# EAGLE design amp (EAGLE 9.6.2)
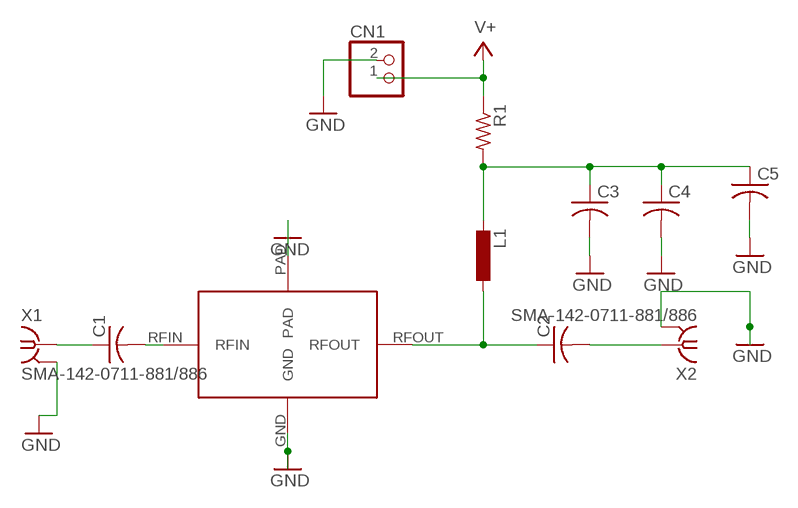
[diagram p0: schematic, sheet 1]

## Parts
C1  C-USC0603  [C0603]
C2  C-USC0603  [C0603]
C3  C-USC0603  [C0603]
C4  C-USC0603  [C0603]
C5  C-USC0603  [C0603]
CN1  JST_2PIN-THM  [JST-PH-2-THM]
L1  L-EUL0603  [L0603]
R1  R-US_R0603  [R0603]
U$1  MMG3001  [SOT-89]
X1  SMA-142-0711-881/886  [J502-ND-142-0711-881/886]
X2  SMA-142-0711-881/886  [J502-ND-142-0711-881/886]

## Nets
GND: C3.2 C4.2 C5.2 CN1.2 U$1.GND U$1.PAD X1.G@1 X1.G@2 X1.G@3 X1.G@4 X2.G@1 X2.G@2 X2.G@3 X2.G@4
N$1: C1.1 X1.1
N$2: C3.1 C4.1 C5.1 L1.2 R1.2
N$3: C2.1 L1.1 U$1.RFOUT
N$4: C1.2 U$1.RFIN
N$5: C2.2 X2.1
V+: CN1.1 R1.1

## Library data of the parts
C1-C5 = rcl:C-US: CAPACITOR, American symbol; SPICEPREFIX: C
CN1 = adafruit:JST_2PIN: JST 2-Pin Connectors of various flavors SMT-RA (S2B-PH-SM4) 4UConnector #17311 SMT (B2B-PH-SM4) THM-RA (S2B-PH) THM (B2B-PH)
L1 = rcl-2:L-EU: INDUCTOR, European symbol
R1 = adafruit:R-US_: RESISTOR, American symbol
U$1 = mmg3001:MMG3001
X1 X2 = con-coax:SMA-: SMA 50 Ohm End Launch Jack Receptacle - Round Contact Johnson Components Source: www.johnsoncomponents.com .. J502-ND.pdf; MF: JOHNSON COMPONENTS; MPN: 142-0711-881; OC_FARNELL: unknown; OC_NEWARK: 50B4464

## Net classes
0 default: width 1.016 mm, drill 0.508 mm, clearance 0.254 mm

## Board
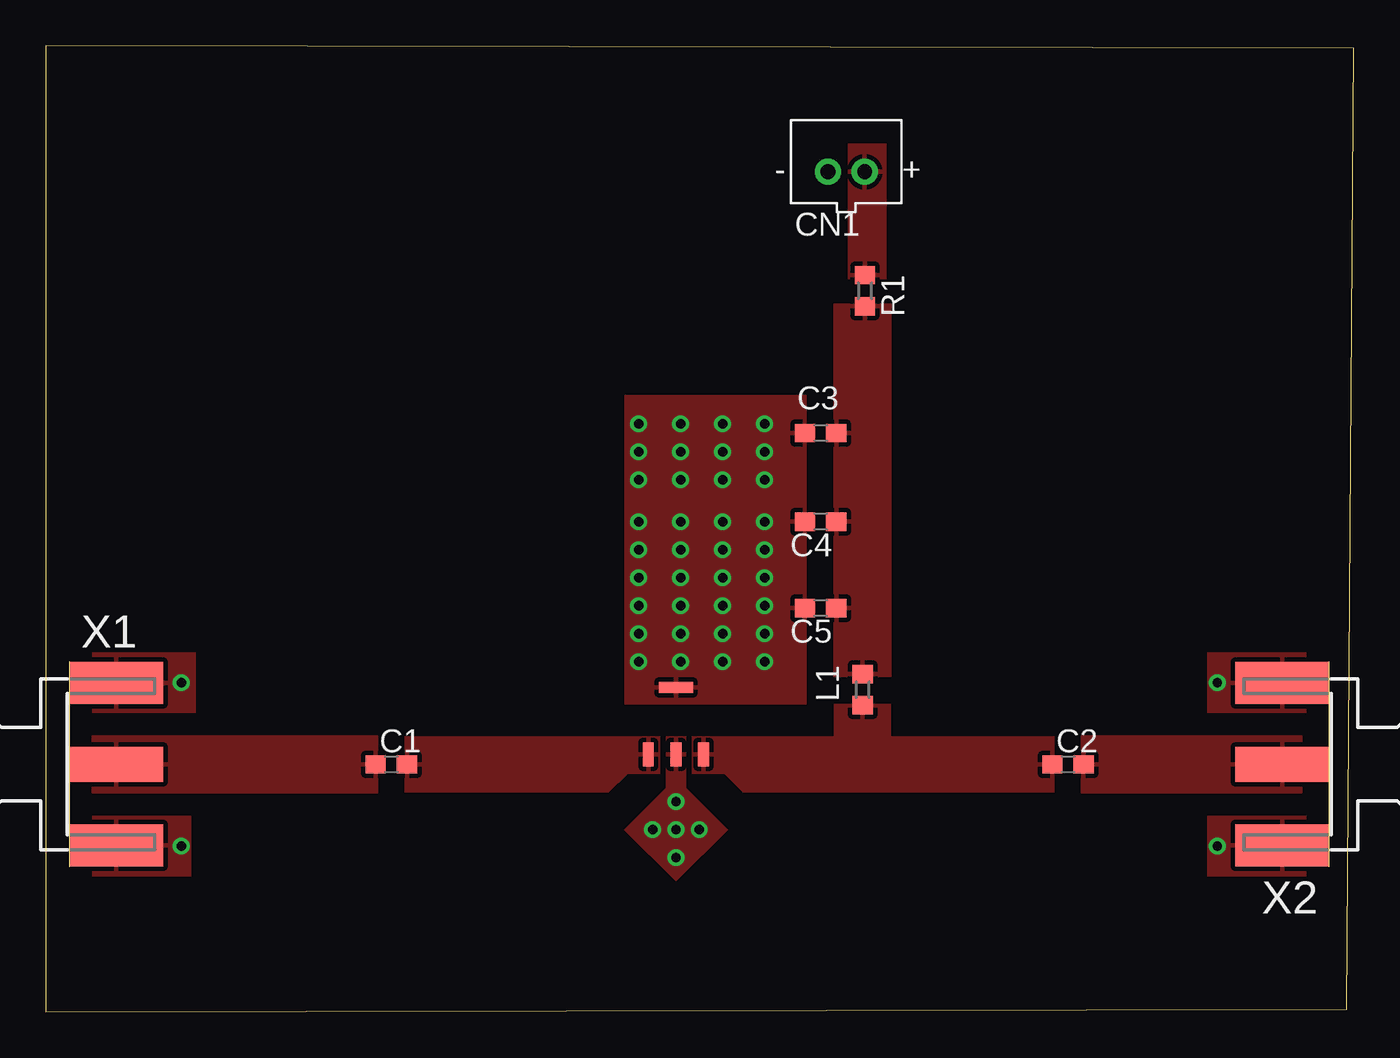
[diagram p1: board, top side]
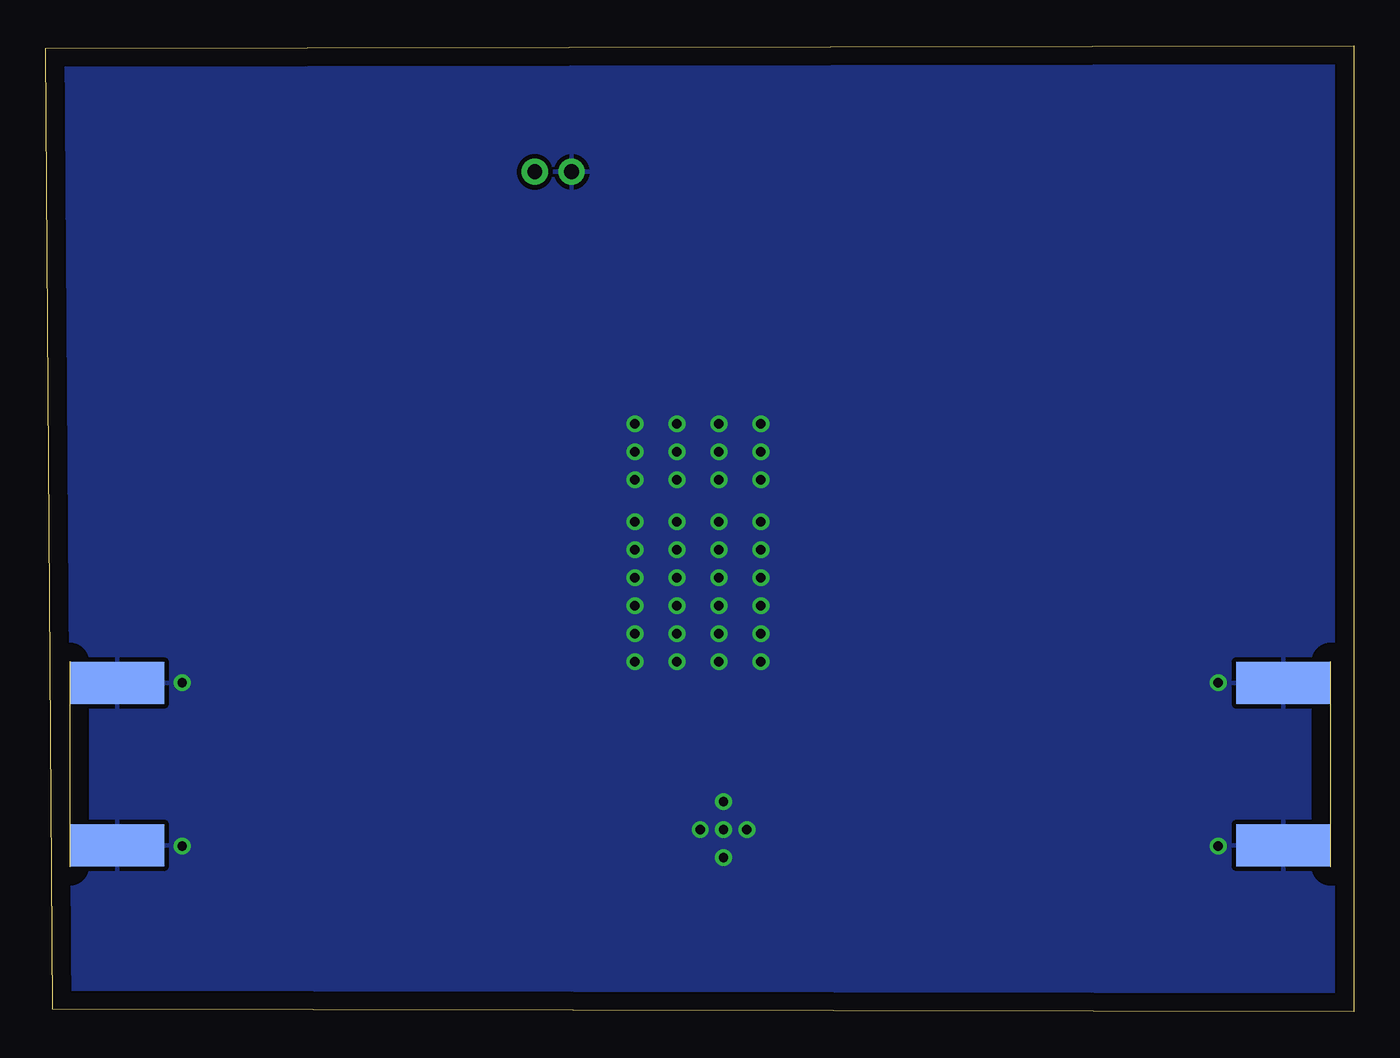
[diagram p2: board, bottom side, seen from below]

Size 71.17 x 52.57 mm. Coordinates in mm from the lower left corner, seen from the top.
Outline: 0,0 70.79,0.13 71.17,52.44 0,52.57 0,0
Copper layers (1*16): Top 0.035mm / dielectric 1.5mm / Bottom 0.035mm
Design rules "default": minimum track width 6mil, minimum drill 0.35mm, track to track 6mil, track to pad 6mil, pad to pad 6mil, via to via 6mil, smd to smd 6mil, copper to edge 40mil, drill to drill 6mil, minimum pad ring 10mil, minimum via ring 8mil, stop-mask expansion 4mil, vias tented up to drill 0mil, thermal gap 10mil

### Footprints (pad centres in the part's own frame; a part is rotated, then mirrored left to right if it is on the bottom)
C0603 = smd 1.1 x 1: 1 -0.85,0; 2 0.85,0
JST-PH-2-THM = drill 0.8 pad 1.422: 1 1,0; 2 -1,0
L0603 = smd 1 x 1.1: 1 -0.85,0; 2 0.85,0
R0603 = smd 1 x 1.1: 1 -0.85,0; 2 0.85,0
SOT-89 = smd 0.58 x 1.3: GND 0,-2; RFIN -1.5,-2; RFOUT 1.5,-2 | smd 1.87 x 0.6: PAD 0,1.65
J502-ND-142-0711-881/886 = smd 5.08 x 1.905: 1 2.565,0 | smd 5.08 x 2.286: G@1 2.565,4.42; G@2 2.565,-4.42 | smd 5.08 x 2.286 bottom: G@3 2.565,4.42; G@4 2.565,-4.42

### Placement (x,y rotation side)
C1  18.8,13.46 0 top
C2  55.63,13.46 0 top
C3  42.16,31.5 180 top
C4  42.16,26.67 180 top
C5  42.16,21.97 180 top
CN1  43.56,45.72 0 top
L1  44.45,17.53 90 top
R1  44.58,39.24 270 top
U$1  34.29,16 0 top
X1  1.27,13.46 0 top
X2  69.85,13.46 180 top

### Tracks (layer width: path | path; a pad name or v marks a point on that pad's centre or on a via)
GND  (via drill 0.51)
  other vias: 39.12,28.96 39.12,30.48 39.12,32 32.26,26.67 32.26,32 36.83,32 34.54,28.96 34.54,25.15 32.26,30.48 34.54,22.1 34.54,20.57 35.56,9.91 33.02,9.91 34.29,8.38 32.26,28.96 32.26,25.15 32.26,23.62 32.26,22.1 32.26,20.57 32.26,19.05 36.83,28.96 36.83,25.15 36.83,22.1 36.83,20.57 36.83,19.05 34.54,19.05 39.12,20.57 39.12,19.05 39.12,25.15 39.12,22.1 39.12,23.62 39.12,26.67 34.54,26.67 36.83,26.67 34.54,32 34.54,30.48 34.54,23.62 36.83,23.62 36.83,30.48 34.29,11.43 34.29,9.91 7.37,17.91 7.37,9.02 63.75,9.02 63.75,17.91
  pour Bottom: -17.27,81.53 84.84,81.53 84.84,0 -16.51,0 -17.27,0.76
  pour Top: 31.5,16.76 41.4,16.76 41.4,33.53 31.5,33.53
  pour Top: 2.54,19.56 8.13,19.56 8.13,16.26 2.54,16.26 2.54,19.43
  pour Top: 2.54,10.67 7.87,10.67 7.87,7.37 2.79,7.37 2.54,7.37
  pour Top: 68.58,19.56 68.58,16.26 63.25,16.26 63.25,19.56
  pour Top: 68.58,10.67 68.58,7.37 63.25,7.37 63.25,10.67
  pour Top: 33.78,14.99 34.8,14.99 34.8,12.19 36.83,10.16 37.08,9.91 34.29,7.11 31.5,9.91 33.78,12.19
N$1
  pour Top: 2.54,14.99 18.03,14.99 18.03,11.94 2.54,11.94
N$2
  pour Top: 42.93,38.48 45.97,38.48 45.97,18.29 42.93,18.29
N$3
  pour Top: 35.18,14.99 42.93,14.99 42.93,16.76 45.97,16.76 45.97,14.99 54.86,14.99 54.86,11.94 37.97,11.94 36.96,12.95 35.18,12.95
N$4
  pour Top: 19.56,14.99 33.4,14.99 33.4,12.95 31.62,12.95 30.61,11.94 19.56,11.94
N$5
  pour Top: 67.56,14.99 56.39,14.99 56.39,11.94 68.33,11.94 68.33,14.99
V+
  pour Top: 43.69,47.24 45.72,47.24 45.72,39.88 43.69,39.88